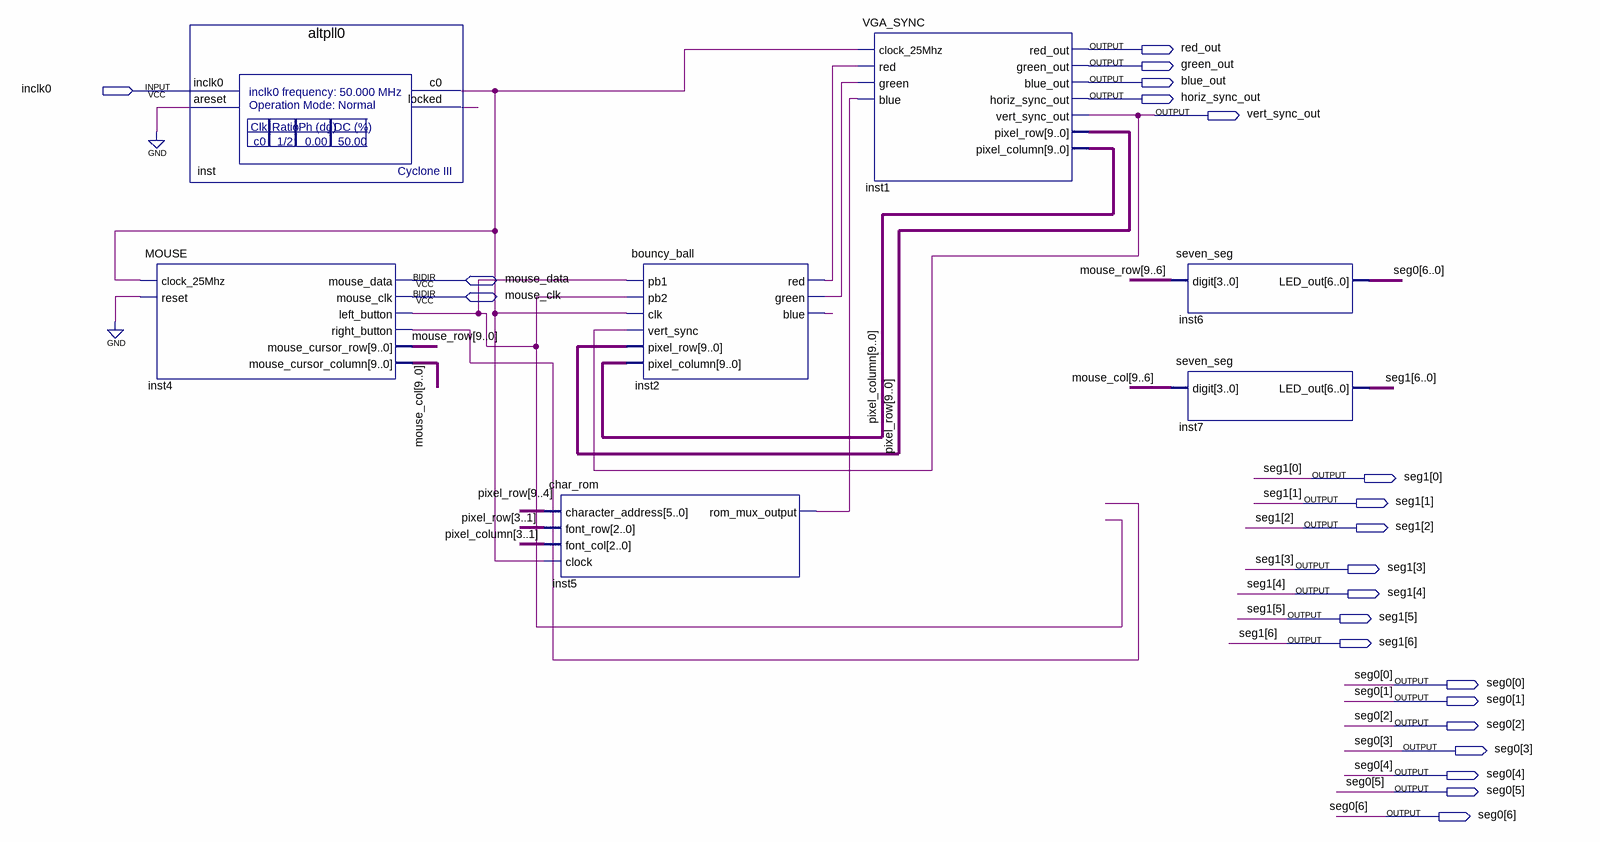
[diagram p0: schematic sheet]
// Quartus schematic BallMovement.bdf as structural Verilog: 7 symbols, 22 pins
module BallMovement (
  input  inclk0,
  inout  mouse_data,
  inout  mouse_clk,
  output red_out,
  output green_out,
  output blue_out,
  output horiz_sync_out,
  output vert_sync_out,
  output [6:0] seg1,
  output [6:0] seg0
);

  wire inst2_blue, inst2_green, inst2_red, inst4_left_button, inst4_right_button, inst5_rom_mux_output,
       inst_c0, inst_locked;
  wire [9:0] mouse_col, mouse_row, pixel_column, pixel_row;

  altpll0 inst (.inclk0(inclk0), .areset(1'b0), .c0(inst_c0), .locked(inst_locked));
  MOUSE inst4 (
    .clock_25Mhz(inst_c0), .reset(1'b0), .left_button(inst4_left_button), .right_button(inst4_right_button),
    .mouse_cursor_row(mouse_row), .mouse_cursor_column(mouse_col), .mouse_data(mouse_data),
    .mouse_clk(mouse_clk));
  char_rom inst5 (
    .character_address(pixel_row[9:4]), .font_row(pixel_row[3:1]), .font_col(pixel_column[3:1]),
    .clock(inst_c0), .rom_mux_output(inst5_rom_mux_output));
  bouncy_ball inst2 (
    .pb1(inst4_left_button), .pb2(inst4_left_button), .clk(inst_c0), .vert_sync(vert_sync_out),
    .pixel_row(pixel_row), .pixel_column(pixel_column), .red(inst2_red), .green(inst2_green),
    .blue(inst2_blue));
  VGA_SYNC inst1 (
    .clock_25Mhz(inst_c0), .red(inst2_red), .green(inst2_green), .blue(inst5_rom_mux_output),
    .red_out(red_out), .green_out(green_out), .blue_out(blue_out), .horiz_sync_out(horiz_sync_out),
    .vert_sync_out(vert_sync_out), .pixel_row(pixel_row), .pixel_column(pixel_column));
  seven_seg inst6 (.digit(mouse_row[9:6]), .LED_out(seg0));
  seven_seg inst7 (.digit(mouse_col[9:6]), .LED_out(seg1));
endmodule
